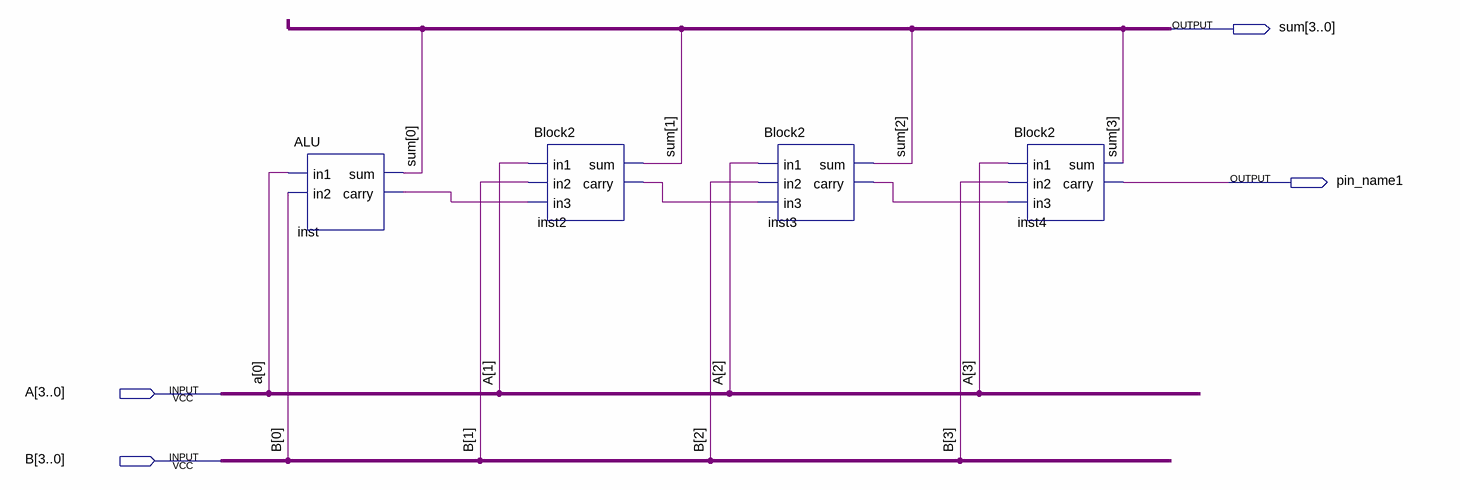
[diagram p0: schematic sheet]
// Quartus schematic Block4.bdf as structural Verilog: 4 symbols, 4 pins
module Block4 (
  input  [3:0] A,
  input  [3:0] B,
  output [3:0] sum,
  output pin_name1
);

  wire inst2_carry, inst3_carry, inst_carry;

  ALU inst (.in1(A[0]), .in2(B[0]), .sum(sum[0]), .carry(inst_carry));
  Block2 inst2 (.in1(A[1]), .in2(B[1]), .in3(inst_carry), .sum(sum[1]), .carry(inst2_carry));
  Block2 inst3 (.in1(A[2]), .in2(B[2]), .in3(inst2_carry), .sum(sum[2]), .carry(inst3_carry));
  Block2 inst4 (.in1(A[3]), .in2(B[3]), .in3(inst3_carry), .sum(sum[3]), .carry(pin_name1));
endmodule
